# Altium schematic sheet connector.SchDoc
size A4
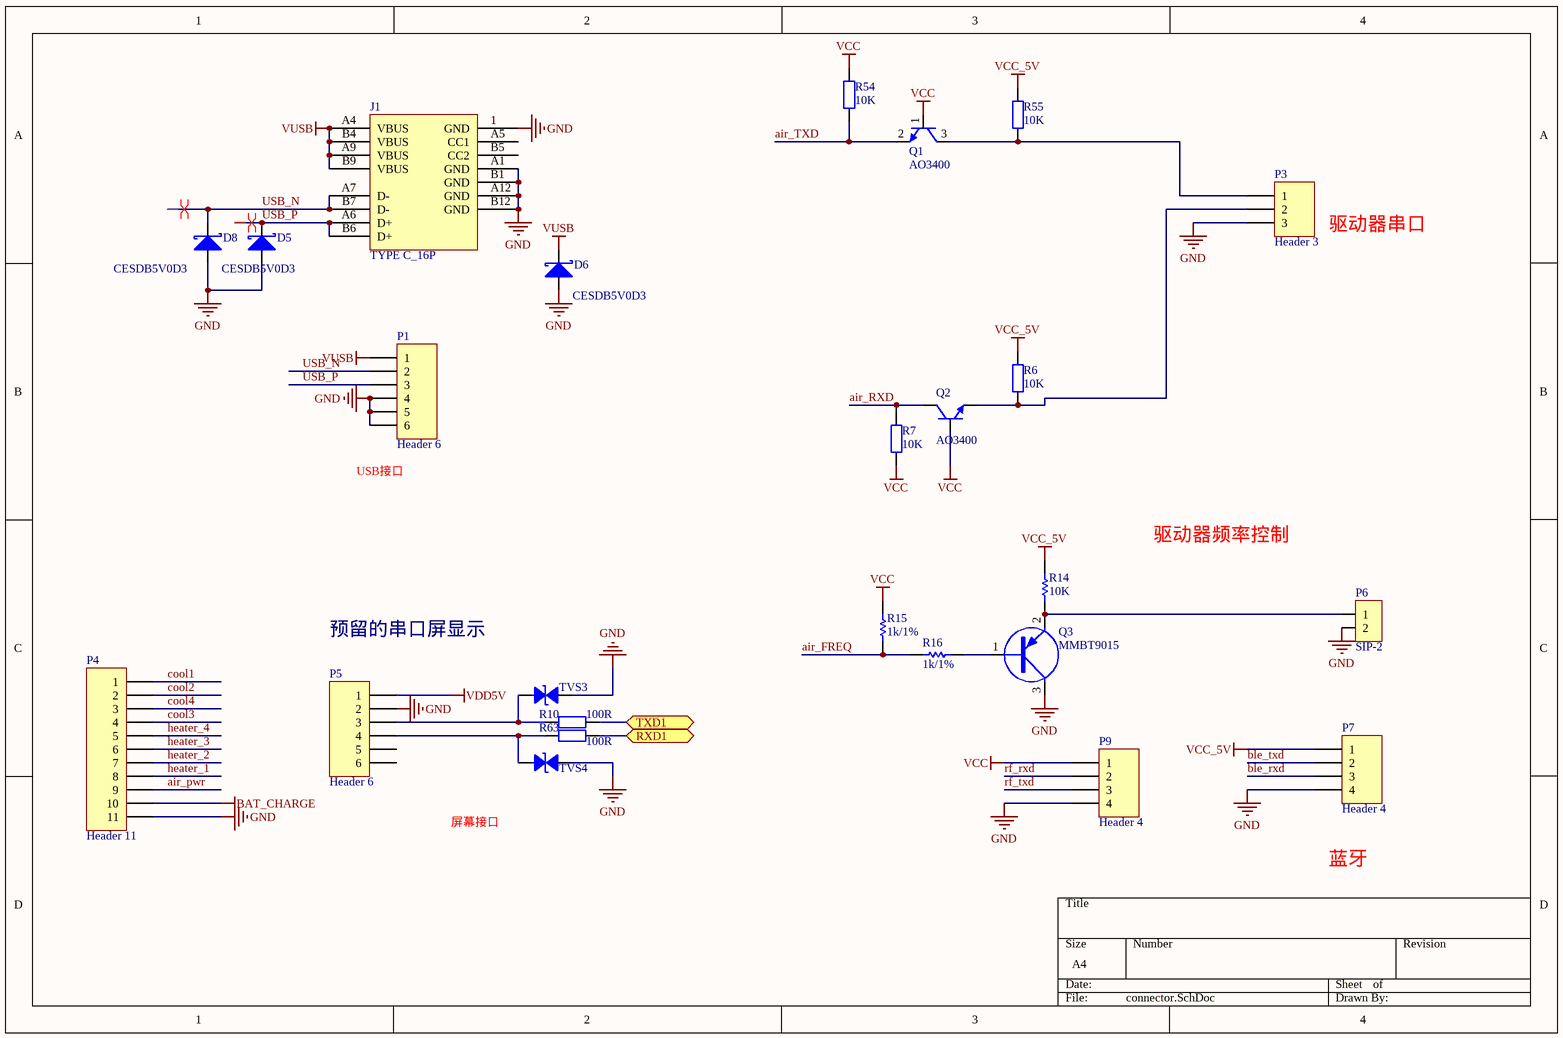
[diagram p0: connector.SchDoc]

## Parts
D5  CESDB5V0D3  [SOD323]
D6  CESDB5V0D3  [SOD323]
D8  CESDB5V0D3  [SOD323]
J1  TYPE C_16P  [TYPEC_16P]
P1  Header 6  [USB-A]
P3  Header 3  [3X2.54MMZ]
P4  Header 11  [12X2MMZ]
P5  Header 6  [6X2MMZ]
P6  SIP-2  [SIP-2A]
P7  Header 4  [4X2.54MMZ]
P9  Header 4  [4X2.54MMZ]
Q1  AO3400  [SOT-23]
Q2  AO3400  [SOT-23]
Q3  MMBT9015  [SOT23-3]
R6  10K  [0603r]
R7  10K  [0603r]
R10  100R  [0603R]
R14  10K  [0603R]
R15  1k/1%  [0603R]
R16  1k/1%  [0603R]
R54  10K  [0603r]
R55  10K  [0603r]
R63  100R  [0603R]
TVS3  ESD5Z5.0CT1G  [SOD-523]  (value not drawn)
TVS4  ESD5Z5.0CT1G  [SOD-523]  (value not drawn)

## Ports
RXD1 (bidir), TXD1 (bidir)

## Nets
BAT_CHARGE: P4.10
GND: D5.1(A) D6.1(A) D8.1(A) J1.1(GND) J1.A1(GND) J1.A12(GND) J1.B1(GND) J1.B12(GND) P1.4 P1.5 P1.6 P3.3 P4.11 P5.2 P6.2 P7.4 P9.4 Q3.3(C) TVS3.1(A) TVS4.1(A)
VCC: P9.1 Q1.1(B) Q2.1(B) R7.1 R15.1 R54.2
VCC_5V: P7.1 R6.2 R14.2 R55.2
VDD5V: P5.1
VUSB: D6.2(K) J1.A4(VBUS) J1.A9(VBUS) J1.B4(VBUS) J1.B9(VBUS) P1.1
air_FREQ: R15.2 R16.2
air_pwr: P4.9
air_RXD: Q2.3(C) R7.2
air_TXD: Q1.2(E) R54.1
ble_rxd: P7.3
ble_txd: P7.2
cool1: P4.1
cool2: P4.2
cool3: P4.4
cool4: P4.3
heater_1: P4.8
heater_2: P4.7
heater_3: P4.6
heater_4: P4.5
rf_rxd: P9.2
rf_txd: P9.3
RXD1: R63.2 ; port RXD1
TXD1: R10.2 ; port TXD1
USB_N: D8.2(K) J1.A7(D-) J1.B7(D-) P1.2
USB_P: D5.2(K) J1.A6(D+) J1.B6(D+) P1.3
NetP3_1: P3.1 Q1.3(C) R55.1
NetP3_2: P3.2 Q2.2(E) R6.1
NetP5_3: P5.3 R10.1 TVS3.2(B)
NetP5_4: P5.4 R63.1 TVS4.2(B)
NetP6_1: P6.1 Q3.2(E) R14.1
NetQ3_1: Q3.1(B) R16.1

Not connected (* = marked no-connect by the designer): J1 A5(CC1) B5(CC2); P5 5 6

## Layout directives
differential pair: USB_N, USB_P

## Notes on the sheet
- 驱动器串口
- (near P1) USB接口
- 驱动器频率控制
- 预留的串口屏显示
- 屏幕接口
- 蓝牙

## Library data of the parts
D5 D6 D8 = DIODE S: Schottky Diode
P1 P5 = Header 6: Header, 6-Pin; LatestRevisionDate: 17-Jul-2002; LatestRevisionNote: Re-released for DXP Platform.; Publisher: Altium Limited
P3 = Header 3: Header, 3-Pin; LatestRevisionDate: 17-Jul-2002; LatestRevisionNote: Re-released for DXP Platform.; Publisher: Altium Limited
P4 = Header 11: Header, 11-Pin; LatestRevisionDate: 17-Jul-2002; LatestRevisionNote: Re-released for DXP Platform.; Publisher: Altium Limited
P6 = SIP-2: XH2.54 2P 立贴
P7 P9 = Header 4: Header, 4-Pin; LatestRevisionDate: 17-Jul-2002; LatestRevisionNote: Re-released for DXP Platform.; Publisher: Altium Limited
Q1 Q2 = NPN-1: NPN
Q3 = PNP
R6 R7 R54 R55 = R: 贴片电阻 1%
R10 R63 = RES2: 贴片电阻 5%
R14-R16 = Res1: Resistor; Published: 8-Jun-2000; LatestRevisionDate: 17-Jul-2002; LatestRevisionNote: Re-released for DXP Platform.; PackageReference: AXIAL-0.3; Publisher: Altium Limited
TVS3 TVS4 = TVS-1: TVS